# Altium schematic sheet FillLevelSensor.SchDoc
size A4
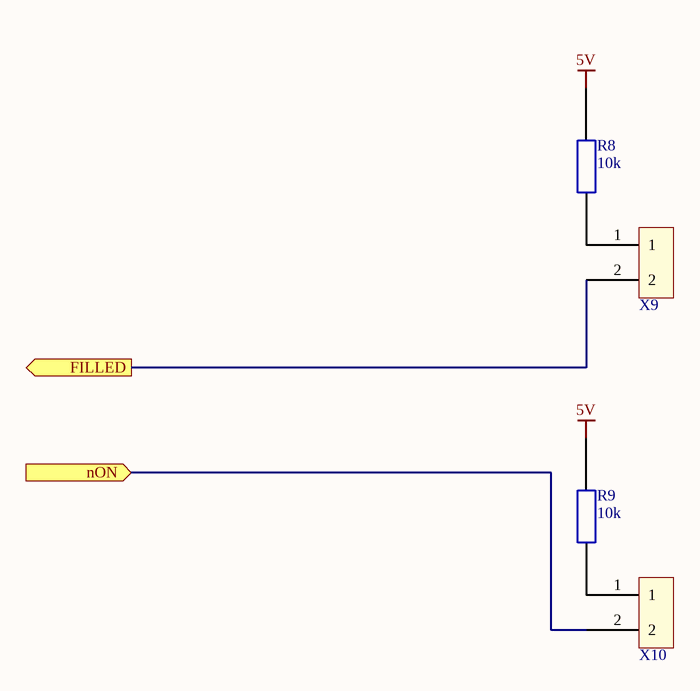
[diagram p0: FillLevelSensor.SchDoc]

## Parts
R8  10k  [Res 0603]
R9  10k  [Res 0603]
X9  2p Connector  [2p 2.54 pitch, diode]  (value not drawn)
X10  2p Connector  [2p 2.54 pitch, diode]  (value not drawn)

## Ports
FILLED (out), nON (in)

## Nets
5V: R8.2 R9.2
FILLED: X9.2 ; port FILLED
nON: X10.2 ; port nON
NetR8_1: R8.1 X9.1
NetR9_1: R9.1 X10.1

## Library data of the parts
R8 R9 = Res: Value: 10k